# EAGLE design mcmega (EAGLE 6.4)
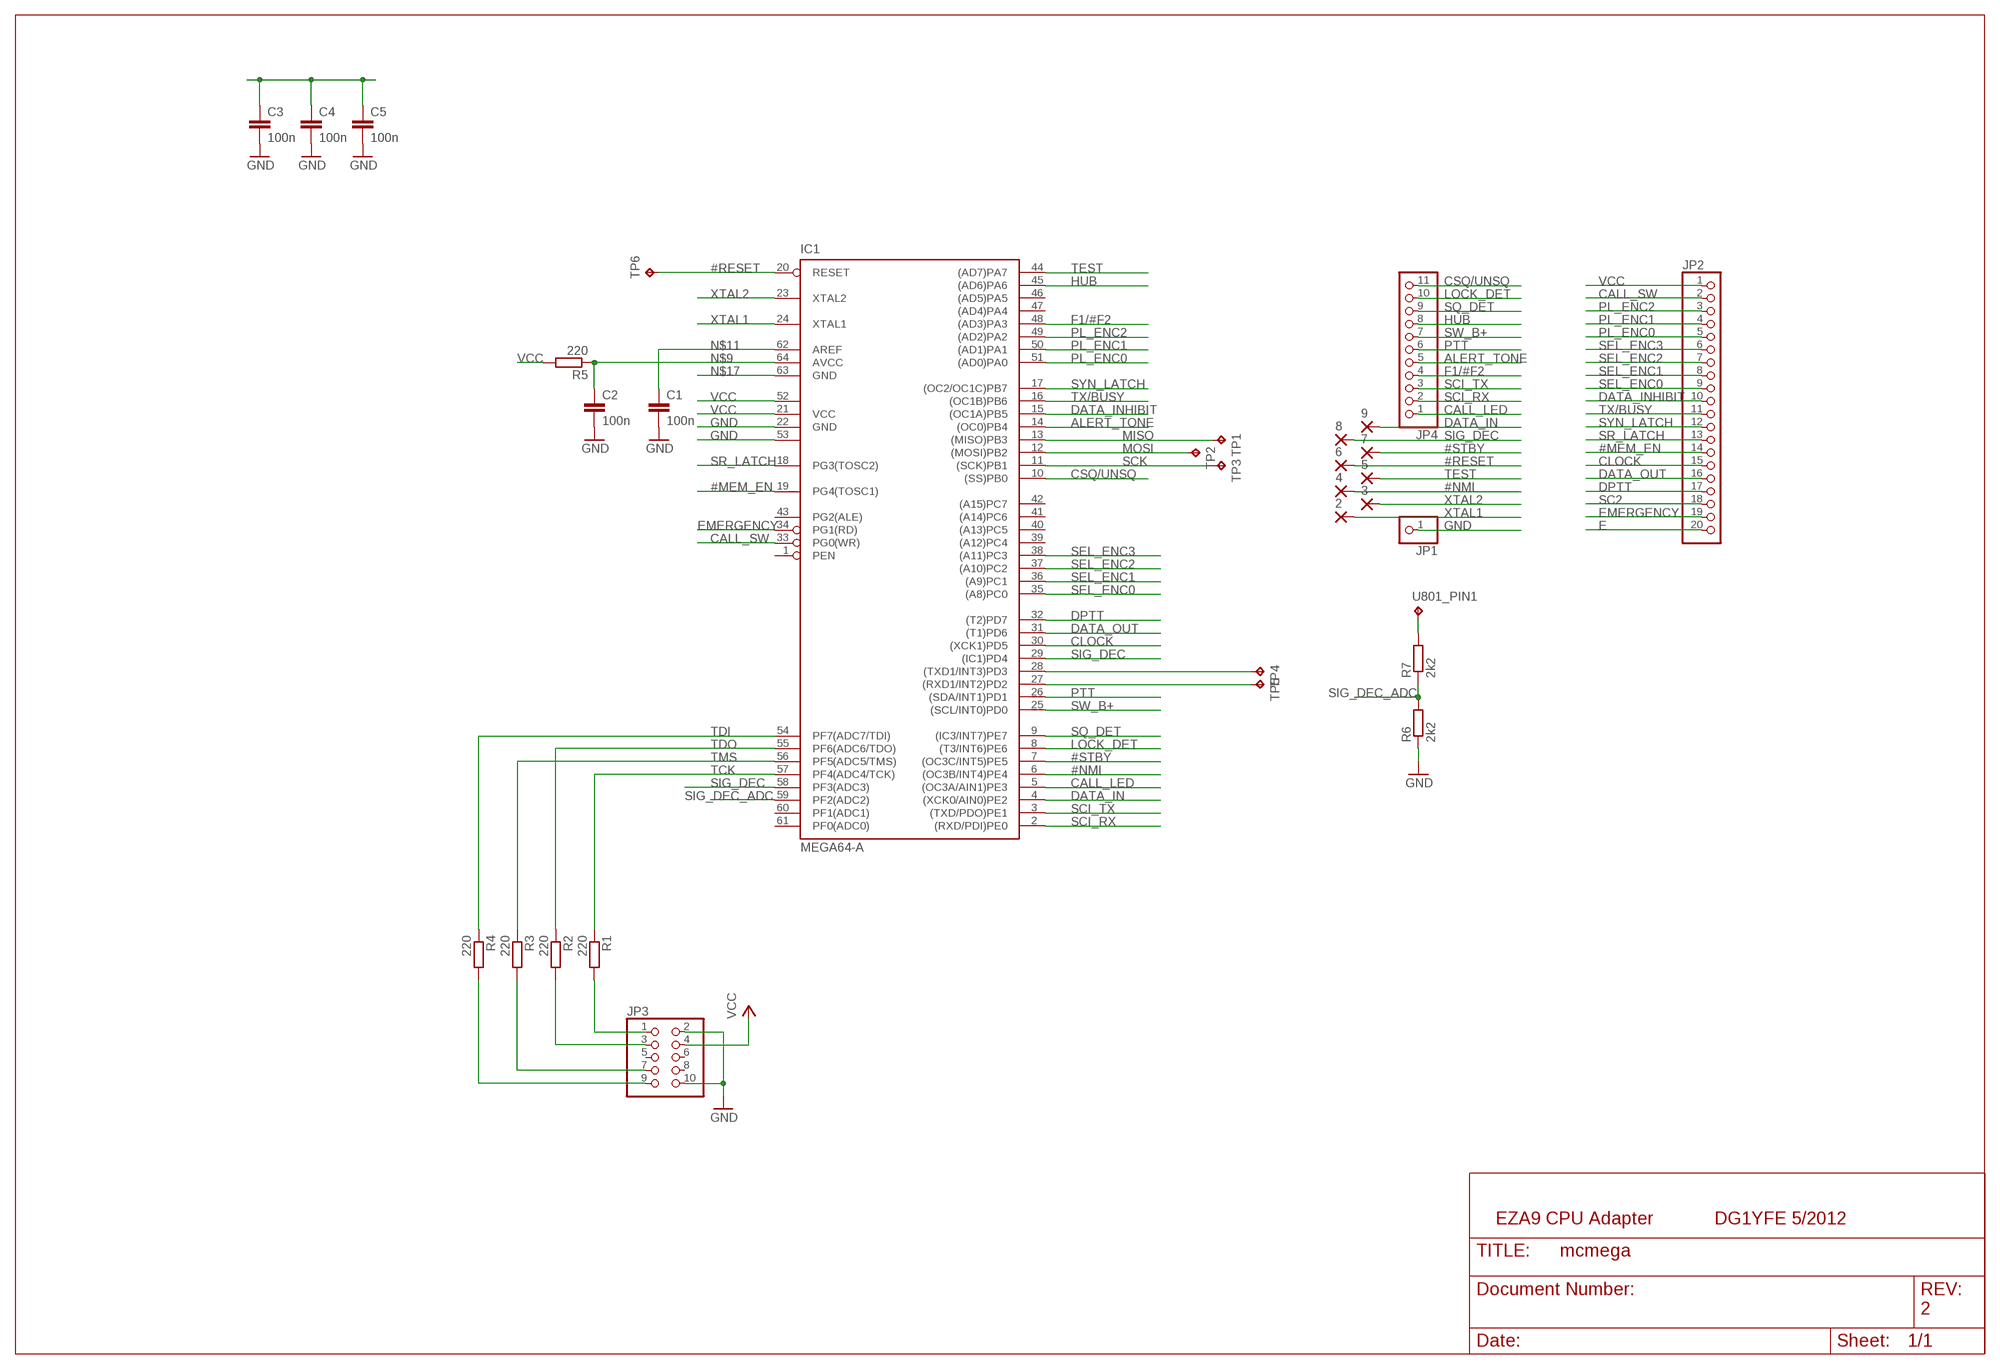
[diagram p0: schematic, sheet 1]

## Parts
2  SMD2  [SMD1,27-2,54]
3  SMD2  [SMD1,27-2,54]
4  SMD2  [SMD1,27-2,54]
5  SMD2  [SMD1,27-2,54]
6  SMD2  [SMD1,27-2,54]
7  SMD2  [SMD1,27-2,54]
8  SMD2  [SMD1,27-2,54]
9  SMD2  [SMD1,27-2,54]
C1  100n  C-EUC0603  [C0603]
C2  100n  C-EUC0603  [C0603]
C3  100n  C-EUC0603  [C0603]
C4  100n  C-EUC0603  [C0603]
C5  100n  C-EUC0603  [C0603]
IC1  MEGA64-A  [TQFP64]
JP1  PINHD-1X1  [1X01]
JP2  PINHD-1X20  [1X20]
JP3  PINHD-2X5  [2X05]
JP4  PINHD-1X11  [1X11]
R1  220  R-EU_R0603  [R0603]
R2  220  R-EU_R0603  [R0603]
R3  220  R-EU_R0603  [R0603]
R4  220  R-EU_R0603  [R0603]
R5  220  R-EU_R0603  [R0603]
R6  2k2  R-EU_R0603  [R0603]
R7  2k2  R-EU_R0603  [R0603]
TP1  TPTP09R  [TP09R]
TP2  TPTP09R  [TP09R]
TP3  TPTP09R  [TP09R]
TP4  TPTP09R  [TP09R]
TP5  TPTP09R  [TP09R]
TP6  TPTP09R  [TP09R]
U801_PIN1  TPTP10R  [TP10R]

## Nets
#MEM_EN: IC1.19(PG4(TOSC1)) JP2.14
#NMI: 4.1(P) IC1.6((OC3B/INT4)PE4)
#RESET: 6.1(P) IC1.20(RESET) TP6.TP
#STBY: 7.1(P) IC1.7((OC3C/INT5)PE5)
ALERT_TONE: IC1.14((OC0)PB4) JP4.5
CALL_LED: IC1.5((OC3A/AIN1)PE3) JP4.1
CALL_SW: IC1.33(PG0(WR)) JP2.2
CLOCK: IC1.30((XCK1)PD5) JP2.15
CSQ/UNSQ: IC1.10((SS)PB0) JP4.11
DATA_IN: 9.1(P) IC1.4((XCK0/AIN0)PE2)
DATA_INHIBIT: IC1.15((OC1A)PB5) JP2.10
DATA_OUT: IC1.31((T1)PD6) JP2.16
DPTT: IC1.32((T2)PD7) JP2.17
E: JP2.20
EMERGENCY: IC1.34(PG1(RD)) JP2.19
F1/#F2: IC1.48((AD3)PA3) JP4.4
GND [Supply]: C1.2 C2.2 C3.2 C4.2 C5.2 IC1.22(GND) IC1.53(GND1) JP1.1 JP3.2 JP3.10 R6.1
HUB: IC1.45((AD6)PA6) JP4.8
LOCK_DET: IC1.8((T3/INT6)PE6) JP4.10
MISO: IC1.13((MISO)PB3) TP1.TP
MOSI: IC1.12((MOSI)PB2) TP2.TP
N$2: JP3.1 R1.2
N$3: JP3.3 R2.2
N$4: JP3.7 R3.2
N$5: JP3.9 R4.2
N$6: R7.2 U801_PIN1.TP
N$9: C2.1 IC1.64(AVCC) R5.1
N$11: C1.1 IC1.62(AREF)
N$14: IC1.28((TXD1/INT3)PD3) TP4.TP
N$15: IC1.27((RXD1/INT2)PD2) TP5.TP
N$17: IC1.63(GND)
PL_ENC0: IC1.51((AD0)PA0) JP2.5
PL_ENC1: IC1.50((AD1)PA1) JP2.4
PL_ENC2: IC1.49((AD2)PA2) JP2.3
PTT: IC1.26((SDA/INT1)PD1) JP4.6
SC2: JP2.18
SCI_RX: IC1.2((RXD/PDI)PE0) JP4.2
SCI_TX: IC1.3((TXD/PDO)PE1) JP4.3
SCK: IC1.11((SCK)PB1) TP3.TP
SEL_ENC0: IC1.35((A8)PC0) JP2.9
SEL_ENC1: IC1.36((A9)PC1) JP2.8
SEL_ENC2: IC1.37((A10)PC2) JP2.7
SEL_ENC3: IC1.38((A11)PC3) JP2.6
SIG_DEC: 8.1(P) IC1.29((IC1)PD4) IC1.58(PF3(ADC3))
SIG_DEC_ADC: IC1.59(PF2(ADC2)) R6.2 R7.1
SQ_DET: IC1.9((IC3/INT7)PE7) JP4.9
SR_LATCH: IC1.18(PG3(TOSC2)) JP2.13
SW_B+: IC1.25((SCL/INT0)PD0) JP4.7
SYN_LATCH: IC1.17((OC2/OC1C)PB7) JP2.12
TCK: IC1.57(PF4(ADC4/TCK)) R1.1
TDI: IC1.54(PF7(ADC7/TDI)) R4.1
TDO: IC1.55(PF6(ADC6/TDO)) R2.1
TEST: 5.1(P) IC1.44((AD7)PA7)
TMS: IC1.56(PF5(ADC5/TMS)) R3.1
TX/BUSY: IC1.16((OC1B)PB6) JP2.11
VCC [Supply]: C3.1 C4.1 C5.1 IC1.21(VCC) IC1.52(VCC1) JP2.1 JP3.4 R5.2
XTAL1: 2.1(P) IC1.24(XTAL1)
XTAL2: 3.1(P) IC1.23(XTAL2)
Unconnected: IC1.1(PEN) IC1.39((A12)PC4) IC1.40((A13)PC5) IC1.41((A14)PC6) IC1.42((A15)PC7) IC1.43(PG2(ALE)) IC1.46((AD5)PA5) IC1.47((AD4)PA4) IC1.60(PF1(ADC1)) IC1.61(PF0(ADC0)) JP3.5 JP3.6 JP3.8

## Notes on the sheet
- EZA9 CPU Adapter | DG1YFE 5/2012
- 2

## Library data of the parts
2-9 = wirepad:SMD2: SMD PAD
C1-C5 = rcl:C-EU: CAPACITOR, European symbol
IC1 = atmel:MEGA64: MICROCONTROLLER 64 Kbytes FLASH 4 Kbytes SRAM 2 Kbytes EEPROM DUAL USART 8-channel 10 bit ADC Source: avr.lbr
JP1 = pinhead:PINHD-1X1: PIN HEADER
JP2 = pinhead:PINHD-1X20: PIN HEADER
JP3 = pinhead:PINHD-2X5: PIN HEADER
JP4 = pinhead:PINHD-1X11: PIN HEADER
R1-R7 = rcl:R-EU_: RESISTOR, European symbol
TP1-TP6 U801_PIN1 = testpad:TP: Test pad

## Net classes
1 Supply: clearance 0.3 mm to class 0, clearance 0.4 mm

## Board
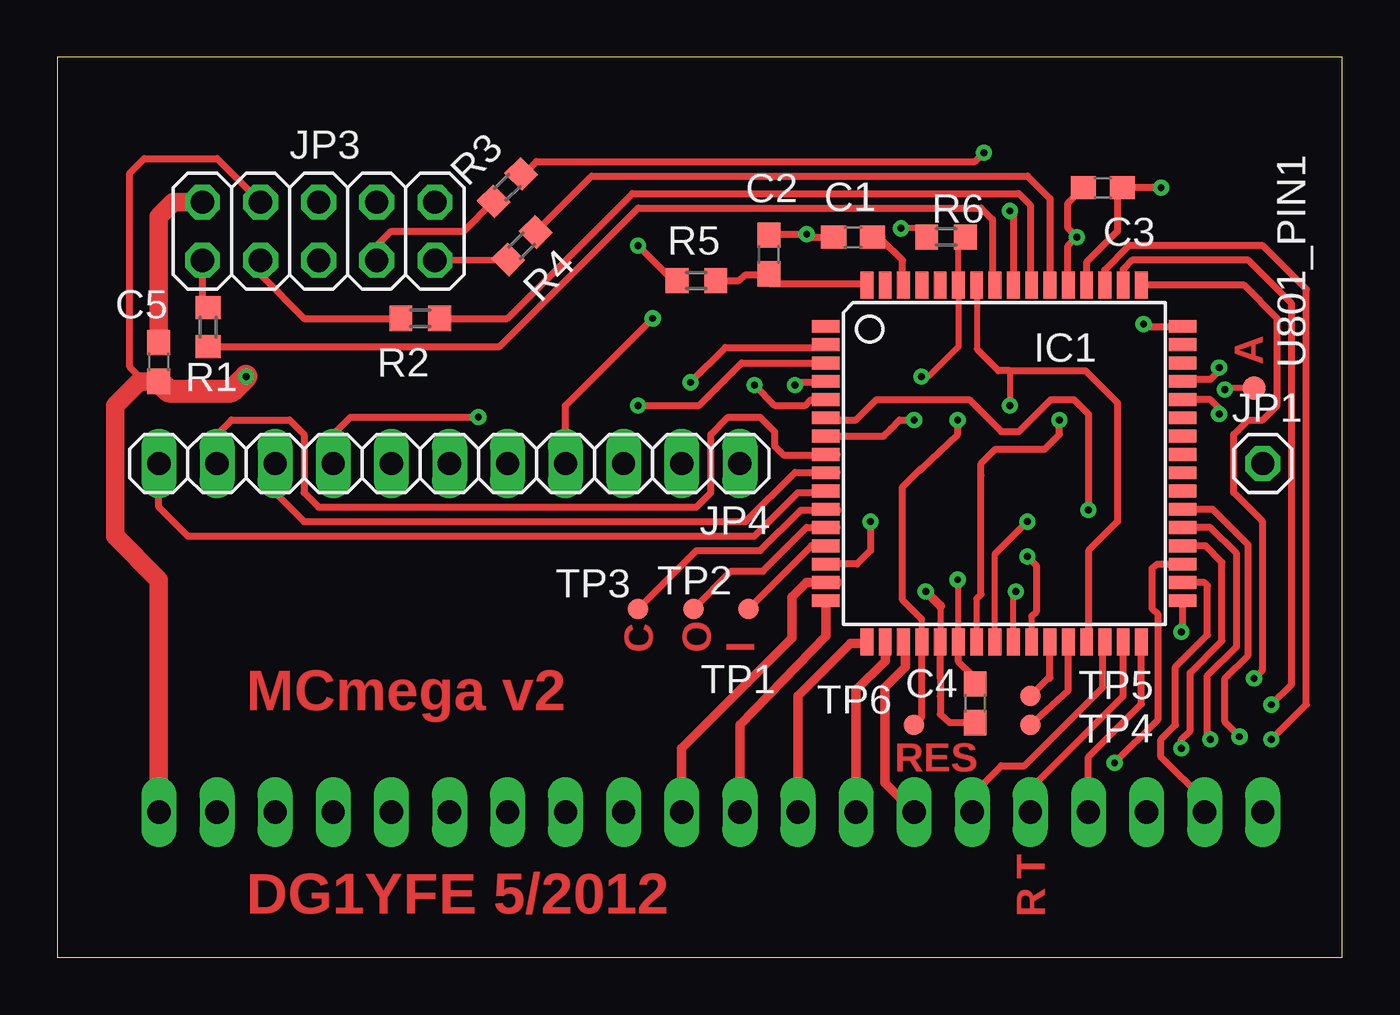
[diagram p1: board, top side]
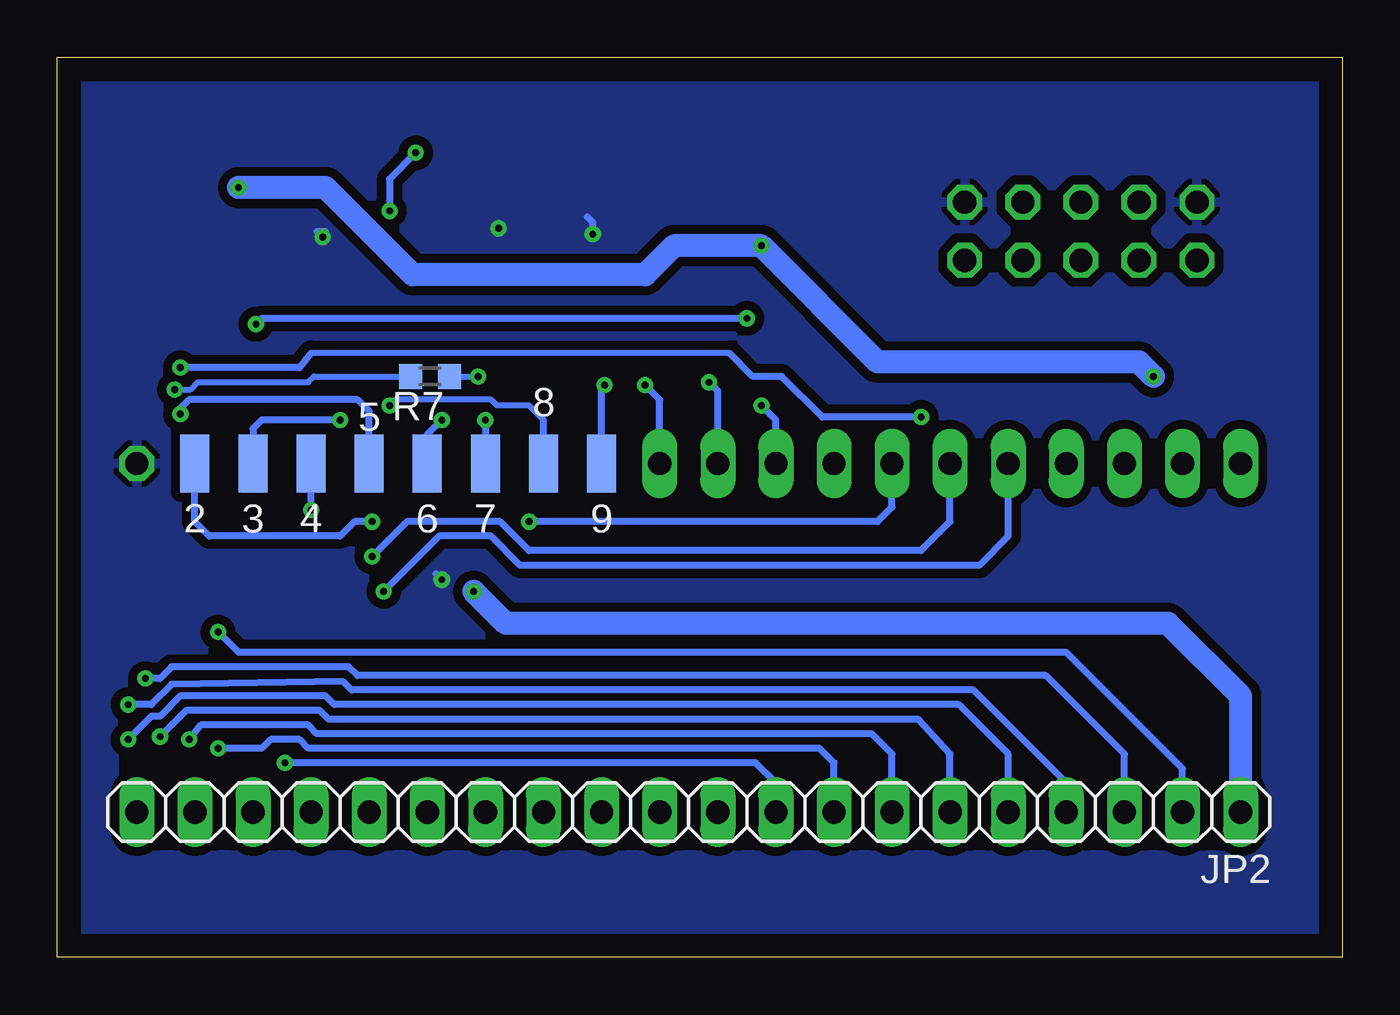
[diagram p2: board, bottom side, seen from below]

Size 56.19 x 39.36 mm. Coordinates in mm from the lower left corner, seen from the top.
Outline: 0,0 56.19,0 56.19,39.36 0,39.36 0,0
Copper layers (1*16): Top 0.035mm / dielectric 1.5mm / Bottom 0.035mm
Design rules "default *": minimum track width 0.15mm, minimum drill 0.3mm, track to track 0.15mm, track to pad 8mil, pad to pad 8mil, via to via 8mil, smd to smd 8mil, copper to edge 40mil, drill to drill 8mil, minimum pad ring 10mil, minimum via ring 8mil, stop-mask expansion 4mil, vias tented up to drill 0mil, thermal gap 10mil
bRestrict: 24 lines

### Footprints (pad centres in the part's own frame; a part is rotated, then mirrored left to right if it is on the bottom)
SMD1,27-2,54 = smd 1.27 x 2.54: 1 0,0
C0603 = smd 1.1 x 1: 1 -0.85,0; 2 0.85,0
TQFP64 = smd 1.194 x 0.559: 1 -7.8,6; 2 -7.8,5.2; 3 -7.8,4.4; 4 -7.8,3.6; 5 -7.8,2.8; 6 -7.8,2; 7 -7.8,1.2; 8 -7.8,0.4; 9 -7.8,-0.4; 10 -7.8,-1.2; 11 -7.8,-2; 12 -7.8,-2.8; 13 -7.8,-3.6; 14 -7.8,-4.4; 15 -7.8,-5.2; 16 -7.8,-6; 33 7.8,-6; 34 7.8,-5.2; 35 7.8,-4.4; 36 7.8,-3.6; 37 7.8,-2.8; 38 7.8,-2; 39 7.8,-1.2; 40 7.8,-0.4; 41 7.8,0.4; 42 7.8,1.2; 43 7.8,2; 44 7.8,2.8; 45 7.8,3.6; 46 7.8,4.4; 47 7.8,5.2; 48 7.8,6 | smd 0.559 x 1.194: 17 -6,-7.8; 18 -5.2,-7.8; 19 -4.4,-7.8; 20 -3.6,-7.8; 21 -2.8,-7.8; 22 -2,-7.8; 23 -1.2,-7.8; 24 -0.4,-7.8; 25 0.4,-7.8; 26 1.2,-7.8; 27 2,-7.8; 28 2.8,-7.8; 29 3.6,-7.8; 30 4.4,-7.8; 31 5.2,-7.8; 32 6,-7.8; 49 6,7.8; 50 5.2,7.8; 51 4.4,7.8; 52 3.6,7.8; 53 2.8,7.8; 54 2,7.8; 55 1.2,7.8; 56 0.4,7.8; 57 -0.4,7.8; 58 -1.2,7.8; 59 -2,7.8; 60 -2.8,7.8; 61 -3.6,7.8; 62 -4.4,7.8; 63 -5.2,7.8; 64 -6,7.8
1X01 = drill 1.016 octagon: 1 0,0
1X20 = drill 1.016 long: 1 -24.13,0; 2 -21.59,0; 3 -19.05,0; 4 -16.51,0; 5 -13.97,0; 6 -11.43,0; 7 -8.89,0; 8 -6.35,0; 9 -3.81,0; 10 -1.27,0; 11 1.27,0; 12 3.81,0; 13 6.35,0; 14 8.89,0; 15 11.43,0; 16 13.97,0; 17 16.51,0; 18 19.05,0; 19 21.59,0; 20 24.13,0
2X05 = drill 1.016 octagon: 1 -5.08,-1.27; 2 -5.08,1.27; 3 -2.54,-1.27; 4 -2.54,1.27; 5 0,-1.27; 6 0,1.27; 7 2.54,-1.27; 8 2.54,1.27; 9 5.08,-1.27; 10 5.08,1.27
1X11 = drill 1.016 long: 1 -12.7,0; 2 -10.16,0; 3 -7.62,0; 4 -5.08,0; 5 -2.54,0; 6 0,0; 7 2.54,0; 8 5.08,0; 9 7.62,0; 10 10.16,0; 11 12.7,0
R0603 = smd 1 x 1.1: 1 -0.85,0; 2 0.85,0
TP09R = smd 0.9 x 0.9: TP 0,0
TP10R = smd 1 x 1: TP 0,0

### Placement (x,y rotation side)
2  50.16,21.59 0 bottom
3  47.62,21.59 0 bottom
4  45.09,21.59 0 bottom
5  42.55,21.59 0 bottom
6  40.01,21.59 0 bottom
7  37.47,21.59 0 bottom
8  34.92,21.59 0 bottom
9  32.38,21.59 0 bottom
C1  34.8,31.5 180 top
C2  31.11,30.73 90 top
C3  45.72,33.66 180 top
C4  40.13,11.11 90 top
C5  4.45,26.04 90 top
IC1  41.4,21.59 0 top
JP1  52.7,21.59 0 top
JP2  28.57,6.35 180 bottom
JP3  11.43,31.75 0 top
JP4  17.14,21.59 180 top
R1  6.6,27.56 90 top
R2  15.88,27.94 180 top
R3  19.68,33.66 225 top
R4  20.32,31.11 225 top
R5  27.94,29.59 180 top
R6  38.86,31.5 0 top
R7  39.88,25.4 180 bottom
TP1  30.23,15.24 90 top
TP2  27.81,15.24 90 top
TP3  25.4,15.24 90 top
TP4  42.55,10.16 0 top
TP5  42.55,11.43 0 top
TP6  37.47,10.16 0 top
U801_PIN1  52.32,24.89 0 top

### Tracks (layer width: path | path; a pad name or v marks a point on that pad's centre or on a via)
#MEM_EN
  Top 0.406: JP2.14 36.2,7.62 36.2,11.81 37.08,12.7 37.08,13.71 IC1.19
#NMI  (via drill 0.3 pad 0.61)
  Top 0.305: v45.09,19.56 45.09,23.75 44.45,24.38 43.43,24.38 42.04,22.99 41.27,22.99 39.88,24.38 35.81,24.38 34.92,23.5 34.2,23.5 IC1.6
  Bottom 0.305: 45.09,21.84 4.1 v45.09,19.56
#RESET  (via drill 0.3 pad 0.61)
  Top 0.254: IC1.20 37.8,14.78
  Top 0.305: 37.8,14.78 36.96,15.62 36.96,20.57 37.72,21.34 37.72,21.3 37.8,21.38 39.37,22.86 v39.37,23.5 | IC1.20 37.8,10.5 TP6.TP
  Bottom 0.305: v39.37,23.5 40.01,22.86 6.1
#STBY  (via drill 0.3 pad 0.61)
  Top 0.305: IC1.7 36.12,22.79 36.45,23.1 36.83,23.5 v37.47,23.5
  Bottom 0.305: v37.47,23.5 7.1 37.47,21.34
ALERT_TONE  (via drill 0.3 pad 0.61)
  Top 0.305: IC1.14 34.97,17.19 35.56,17.78 v35.56,19.05
  Bottom 0.305: v35.56,19.05 20.32,19.05 19.68,19.68 JP4.5
CALL_LED  (via drill 0.3 pad 0.61)
  Top 0.305: v30.48,25.02 31.37,24.13 32.71,24.13 32.96,24.38 33.15,24.38 IC1.5
  Bottom 0.305: JP4.1 29.84,24.38 v30.48,25.02
CALL_SW  (via drill 0.3 pad 0.61)
  Top 0.305: IC1.33 49.2,14.28 v49.15,14.22
  Bottom 0.305: JP2.2 6.99,8.26 12.06,13.34 48.26,13.34 v49.15,14.22
CLOCK
  Top 0.305: 40.01,7.11 41.27,8.38 42.29,8.38 45.72,11.81 45.72,13.74
  Top 0.406: JP2.15 40.01,7.11 | 45.72,13.74 IC1.30
CSQ/UNSQ
  Top 0.305: JP4.11 4.45,19.68 5.71,18.41 30.48,18.41 32.38,20.32 34.04,20.32 IC1.10
DATA_IN  (via drill 0.3 pad 0.61)
  Top 0.305: v32.26,25.02 32.38,25.15 32.51,25.15 33.56,25.15 IC1.4
  Bottom 0.305: 9.1 32.38,24.89 v32.26,25.02
DATA_INHIBIT
  Top 0.406: JP2.10 27.3,9.14 32.13,13.97 32.13,15.75 32.77,16.38 34.1,16.38 IC1.15
DATA_OUT
  Top 0.305: IC1.31 46.6,11.42 42.55,7.37
  Top 0.406: JP2.16 42.55,7.37
DPTT
  Top 0.305: IC1.32 47.4,11.08 45.09,8.76 JP2.17
EMERGENCY
  Top 0.305: IC1.34 50.16,16.39 50.29,16.26 50.29,14.1 48.9,12.7 48.9,10.16 48.26,9.53 48.26,8.76 50.16,6.86 JP2.19
F1/#F2  (via drill 0.3 pad 0.61)
  Top 0.305: JP4.4 22.23,24.13 v26.04,27.94 | IC1.48 47.53,27.59 v47.5,27.69
  Bottom 0.305: v26.04,27.94 47.24,27.94 v47.5,27.69
GND  (via drill 0.3 pad 0.3, 0.3 pad 0.61)
  Top 0.254: IC1.22 39.4,16.48 | R6.1 37.88,31.71 37.72,31.88 v36.89,31.88
  Top 0.305: IC1.22 39.4,12.92 40.01,12.32 40.01,11.77 C4.2 | C2.2 31.15,31.62 v32.77,31.62 32.89,31.5 C1.2 | IC1.53 44.2,31.11 v44.58,31.5 44.2,31.88 44.2,32.98 C3.2 | 39.4,16.48 v39.37,16.51
  Top 0.813: C5.2 4.45,32.38 5.08,33.02 JP3.2
  Bottom 0.254: v36.89,31.88 36.96,31.62 36.83,31.75
  Bottom 0.305: v32.77,31.62 32.77,32.13 33.02,32.38 | v44.58,31.5 44.83,31.75 44.45,31.75 | v39.37,16.51 39.62,16.76
  pour Bottom: 0.64,0.64 0.64,38.1 55.24,38.1 55.24,0.64
HUB  (via drill 0.3 pad 0.61)
  Top 0.305: IC1.45 49.28,25.27 50.42,25.27 50.67,25.53 v50.8,25.78 | v18.41,23.62 12.83,23.62 12.06,22.86 JP4.8
  Bottom 0.254: 26.8,26.42 45.09,26.42
  Bottom 0.305: v50.8,25.78 45.59,25.78 45.09,26.42 | 26.8,26.42 25.78,25.4 24.51,25.4 22.73,23.62 v18.41,23.62
LOCK_DET
  Top 0.305: IC1.8 34.09,21.97 31.75,21.97 31.37,22.35 31.37,22.99 30.73,23.62 29.34,23.62 28.57,22.86 28.57,20.32 27.94,19.68 11.43,19.68 10.79,20.32 10.79,22.86 10.16,23.5 7.62,23.5 6.99,22.86 JP4.10
MISO
  Top 0.305: IC1.13 32.98,17.99 TP1.TP
MOSI
  Top 0.305: TP2.TP 29.46,16.89 30.86,16.89 32.77,18.8 34.1,18.8 IC1.12
N$2
  Top 0.305: JP3.1 6.35,28.66 R1.2
N$3
  Top 0.305: JP3.3 8.89,29.84 10.79,27.94 R2.2
N$4
  Top 0.305: JP3.7 13.97,31.11 14.61,31.75 17.78,31.75 R3.2
N$5
  Top 0.305: JP3.9 R4.2
N$6  (via drill 0.3 pad 0.3)
  Top 0.254: U801_PIN1.TP 51.12,24.89 v51.05,24.83
  Bottom 0.254: v51.05,24.83 50.35,24.83 50.04,25.15 45.21,25.15 44.96,25.4 R7.2
N$9
  Top 0.305: C2.1 31.11,30.1 | C2.1 31.11,29.46 35.33,29.46 IC1.64 | R5.1 29.81,29.59 30.1,29.84 31.08,29.84 C2.1
N$11
  Top 0.305: C1.1 36.07,31.5 36.07,31.37 36.96,30.48 36.96,29.43 IC1.62
N$14
  Top 0.305: IC1.28 44.2,11.68 TP4.TP
N$15
  Top 0.305: IC1.27 43.4,12.22 43.37,12.19 43.31,12.19 TP5.TP
PL_ENC0  (via drill 0.3 pad 0.61)
  Top 0.305: IC1.51 45.8,30.05 46.86,31.11 52.7,31.11 54.61,29.21 54.61,11.05 v53.09,9.53
  Bottom 0.305: JP2.5 14.61,8.89 16.76,11.05 44.07,11.05 44.45,11.43 50.8,11.43 51.69,10.54 52.07,10.54 v53.09,9.53
PL_ENC1  (via drill 0.3 pad 0.61)
  Top 0.305: IC1.50 46.6,30.09 46.99,30.48 52.07,30.48 53.98,28.57 53.98,11.94 v53.09,11.05
  Bottom 0.305: JP2.4 12.06,7.62 16.13,11.68 43.31,11.68 43.69,12.06 51.18,11.94 52.07,11.05 v53.09,11.05
PL_ENC2  (via drill 0.3 pad 0.61)
  Top 0.305: IC1.49 51.89,29.39 53.34,27.94 53.34,24.13 52.7,23.5 52.07,23.5 51.44,22.86 51.44,20.32 52.7,19.05 52.7,12.57 v52.32,12.19
  Bottom 0.305: JP2.3 9.53,8.89 12.95,12.32 43.05,12.32 43.43,12.7 51.18,12.7 51.69,12.19 v52.32,12.19
PTT  (via drill 0.3 pad 0.61)
  Top 0.254: 42.6,14.92 IC1.26
  Top 0.305: 42.6,14.92 42.8,15.11 42.8,17.14 v42.42,17.53
  Bottom 0.305: JP4.6 17.14,19.05 18.41,17.78 35.56,17.78 36.83,19.05 40.89,19.05 v42.42,17.53
SCI_RX  (via drill 0.3 pad 0.61)
  Top 0.305: v27.69,25.15 29.21,26.67 33.48,26.67 IC1.2
  Bottom 0.305: JP4.2 27.3,24.77 v27.69,25.15
SCI_TX  (via drill 0.3 pad 0.61)
  Top 0.305: IC1.3 29.93,25.99 28.07,24.13 v25.4,24.13
  Bottom 0.305: v25.4,24.13 24.77,23.5 JP4.3
SCK
  Top 0.305: TP3.TP 27.94,17.78 30.73,17.78 32.51,19.56 34.14,19.56 IC1.11
SEL_ENC0  (via drill 0.3 pad 0.61)
  Top 0.305: IC1.35 48.09,17.19 47.88,17.02 47.88,15.24 48.13,14.99 48.13,10.41 v46.23,8.51
  Bottom 0.305: JP2.9 24.77,7.62 25.65,8.51 v46.23,8.51
SEL_ENC1  (via drill 0.3 pad 0.61)
  Top 0.305: IC1.36 50.21,17.99 50.93,17.27 50.93,13.84 49.53,12.45 49.53,9.91 49.15,9.53 v49.15,9.14
  Bottom 0.305: JP2.8 22.23,8.51 22.86,9.14 45.21,9.14 45.59,9.53 46.86,9.53 47.24,9.14 v49.15,9.14
SEL_ENC2  (via drill 0.3 pad 0.61)
  Top 0.305: IC1.37 50.42,18.79 51.56,17.65 51.56,13.59 50.29,12.32 50.29,9.65 v50.42,9.53
  Bottom 0.305: JP2.7 19.68,8.89 20.57,9.78 44.83,9.78 45.21,10.16 49.91,10.16 v50.42,9.53
SEL_ENC3  (via drill 0.3 pad 0.61)
  Top 0.305: IC1.38 50.51,19.59 52.07,18.03 52.07,13.21 51.05,12.19 51.05,10.29 v51.69,9.65
  Bottom 0.305: JP2.6 17.14,8.89 18.54,10.41 44.32,10.41 44.7,10.79 50.55,10.79 v51.69,9.65
SIG_DEC  (via drill 0.3 pad 0.3)
  Top 0.254: 41.66,25.65 v41.66,24.13 | IC1.58 40.2,26.6 40.26,26.54
  Top 0.305: IC1.29 45.09,13.87 45.09,17.78 46.35,19.05 46.35,24.26 44.96,25.65 41.66,25.65 41.15,25.65 40.26,26.54
  Bottom 0.254: 34.92,23.5 35.56,24.13 36.96,24.13 37.21,24.38 41.4,24.38 v41.66,24.13
  Bottom 0.305: 8.1 34.92,23.5
SIG_DEC_ADC  (via drill 0.3 pad 0.3)
  Top 0.15: 39.4,31.43 39.64,31.43 R6.2
  Top 0.254: v37.78,25.4 38.1,25.4 39.4,26.7 IC1.59 39.4,31.43
  Bottom 0.254: R7.1 v37.78,25.4
SQ_DET
  Top 0.305: IC1.9 34.09,21.21 32.26,21.21 30.1,19.05 10.79,19.05 9.53,20.32 JP4.9
SR_LATCH
  Top 0.406: IC1.18 36.2,12.96 34.92,11.68 JP2.13
SW_B+  (via drill 0.3 pad 0.61)
  Top 0.254: 41.78,15.88 41.78,13.81
  Top 0.305: v41.91,16 41.78,15.88 | 41.78,13.81 IC1.25
  Bottom 0.305: JP4.7 14.61,18.41 15.88,17.14 35.94,17.14 37.21,18.41 39.5,18.41 v41.91,16
SYN_LATCH
  Top 0.406: JP2.12 32.38,11.43 34.67,13.72 35.18,13.72 35.27,13.69 IC1.17
TCK
  Top 0.305: R1.1 19.34,26.71 25.4,32.77 40.39,32.77 40.89,32.26 40.89,29.5 IC1.57
TDI
  Top 0.305: R4.1 23.37,34.16 42.42,34.16 43.4,33.18 IC1.54
TDO
  Top 0.305: R2.1 19.68,27.94 25.15,33.4 42.04,33.4 42.55,32.89 42.55,29.45 IC1.55
TEST  (via drill 0.3 pad 0.61)
  Top 0.305: v50.8,23.75 50.8,24 50.42,24.38 IC1.44
  Bottom 0.305: 5.1 42.55,23.88 43.05,24.38 50.42,24.38 50.8,24 v50.8,23.75
TMS  (via drill 0.3 pad 0.61)
  Top 0.305: R3.1 20.25,34.29 20.45,34.29 20.95,34.8 40.13,34.8 v40.51,35.18 | IC1.56 41.8,32.49 v41.66,32.64
  Bottom 0.305: v41.66,32.64 41.66,34.04 v40.51,35.18
TX/BUSY
  Top 0.406: JP2.11 29.84,10.16 33.6,14.04 IC1.16
VCC  (via drill 0.3 pad 0.61)
  Top 0.254: 38.61,15.37 IC1.21
  Top 0.305: IC1.21 38.6,12.87 38.61,11.43 38.61,10.63 38.99,10.29 39.01,10.26 C4.1 | 45.09,29.47 IC1.52 45,30.4 46.35,31.75 46.35,33.44 C3.1 v48.26,33.66 | JP3.4 6.99,34.92 3.81,34.92 3.17,34.29 3.17,25.82 3.81,25.18 | R5.2 27.05,29.55 26.92,29.59 v25.4,31.11
  Top 0.406: v37.97,16 38.61,15.37 | IC1.21
  Top 0.813: C5.1 3.81,25.18 3.6,25.18 2.54,24.13 2.54,18.41 4.45,16.51 JP2.1
  Top 1.016: v8.26,25.4 7.62,24.77 4.87,24.77 C5.1
  Bottom 1.016: JP2.1 4.45,11.43 7.62,14.61 36.58,14.61 v37.97,16 | v48.26,33.66 44.45,33.66 40.64,29.84 30.48,29.84 29.21,31.11 v25.4,31.11 20.32,26.04 8.89,26.04 v8.26,25.4
XTAL1  (via drill 0.3 pad 0.61)
  Top 0.254: IC1.24 41,17.63
  Top 0.305: 41,17.63 v42.42,19.05
  Bottom 0.305: v42.42,19.05 43.18,19.05 43.81,18.41 49.53,18.41 50.16,19.05 2.1
XTAL2  (via drill 0.3 pad 0.61)
  Top 0.254: IC1.23 40.2,15.69
  Top 0.3: 40.39,21.08 40.39,21.59 41.02,22.23 41.54,22.23
  Top 0.305: 40.2,15.69 40.39,15.88 40.39,21.08 | 41.54,22.23 43.18,22.23 43.81,22.86 v43.81,23.5
  Bottom 0.305: v43.81,23.5 47.24,23.5 47.62,23.11 3.1

### Text on the board
Top: A | C | O | I | MCmega v2 | RES | T | DG1YFE 5/2012 | R